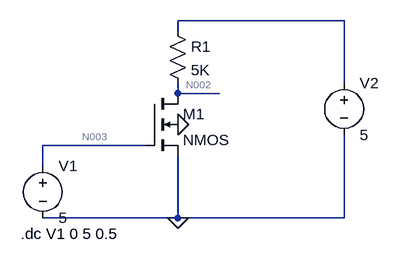
[diagram p0: schematic Resistive_load.asc]
Resistive_load.asc, the LTspice schematic file:
Version 4
SHEET 1 880 680
WIRE 480 0 224 0
WIRE 224 16 224 0
WIRE 480 96 480 0
WIRE 224 112 224 96
WIRE 288 112 224 112
WIRE 176 192 16 192
WIRE 16 224 16 192
WIRE 224 304 224 208
WIRE 224 304 16 304
WIRE 480 304 480 176
WIRE 480 304 224 304
FLAG 224 160 0
FLAG 224 304 0
SYMBOL nmos4 176 112 R0
SYMATTR InstName M1
SYMATTR Value2 l=30 w=50
SYMBOL res 208 0 R0
SYMATTR InstName R1
SYMATTR Value 5K
SYMBOL voltage 16 208 R0
WINDOW 123 0 0 Left 2
WINDOW 39 0 0 Left 2
SYMATTR InstName V1
SYMATTR Value 5
SYMBOL voltage 480 80 R0
WINDOW 123 0 0 Left 2
WINDOW 39 0 0 Left 2
SYMATTR InstName V2
SYMATTR Value 5
TEXT -18 328 Left 2 !.dc V1 0 5 0.5

The netlist it stands for:
* Resistive_load.asc
M1 N002 N003 0 0 NMOS l=30 w=50
R1 N001 N002 5K
V1 N003 0 5
V2 N001 0 5
.model NMOS NMOS
.model PMOS PMOS
.lib standard.mos
.dc V1 0 5 0.5
.backanno
.end

* Results of the author's LTspice run, read from the files saved beside the schematic
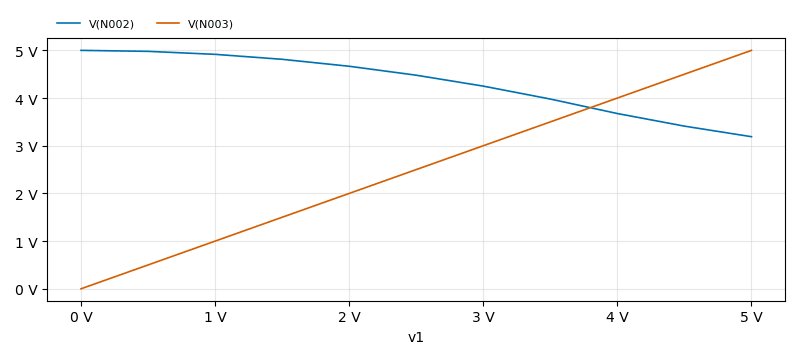
[diagram p1: DC transfer characteristic of Resistive_load.asc, plotted from the saved traces]
* DC transfer characteristic, 1 run:
*   V(N002): 5 V at v1=0 V, 3.19 V at v1=5 V, min 3.19 V, max 5 V
*   V(N003): 0 V at v1=0 V, 5 V at v1=5 V, min 0 V, max 5 V